# EAGLE design appleii (EAGLE 9.6.1)
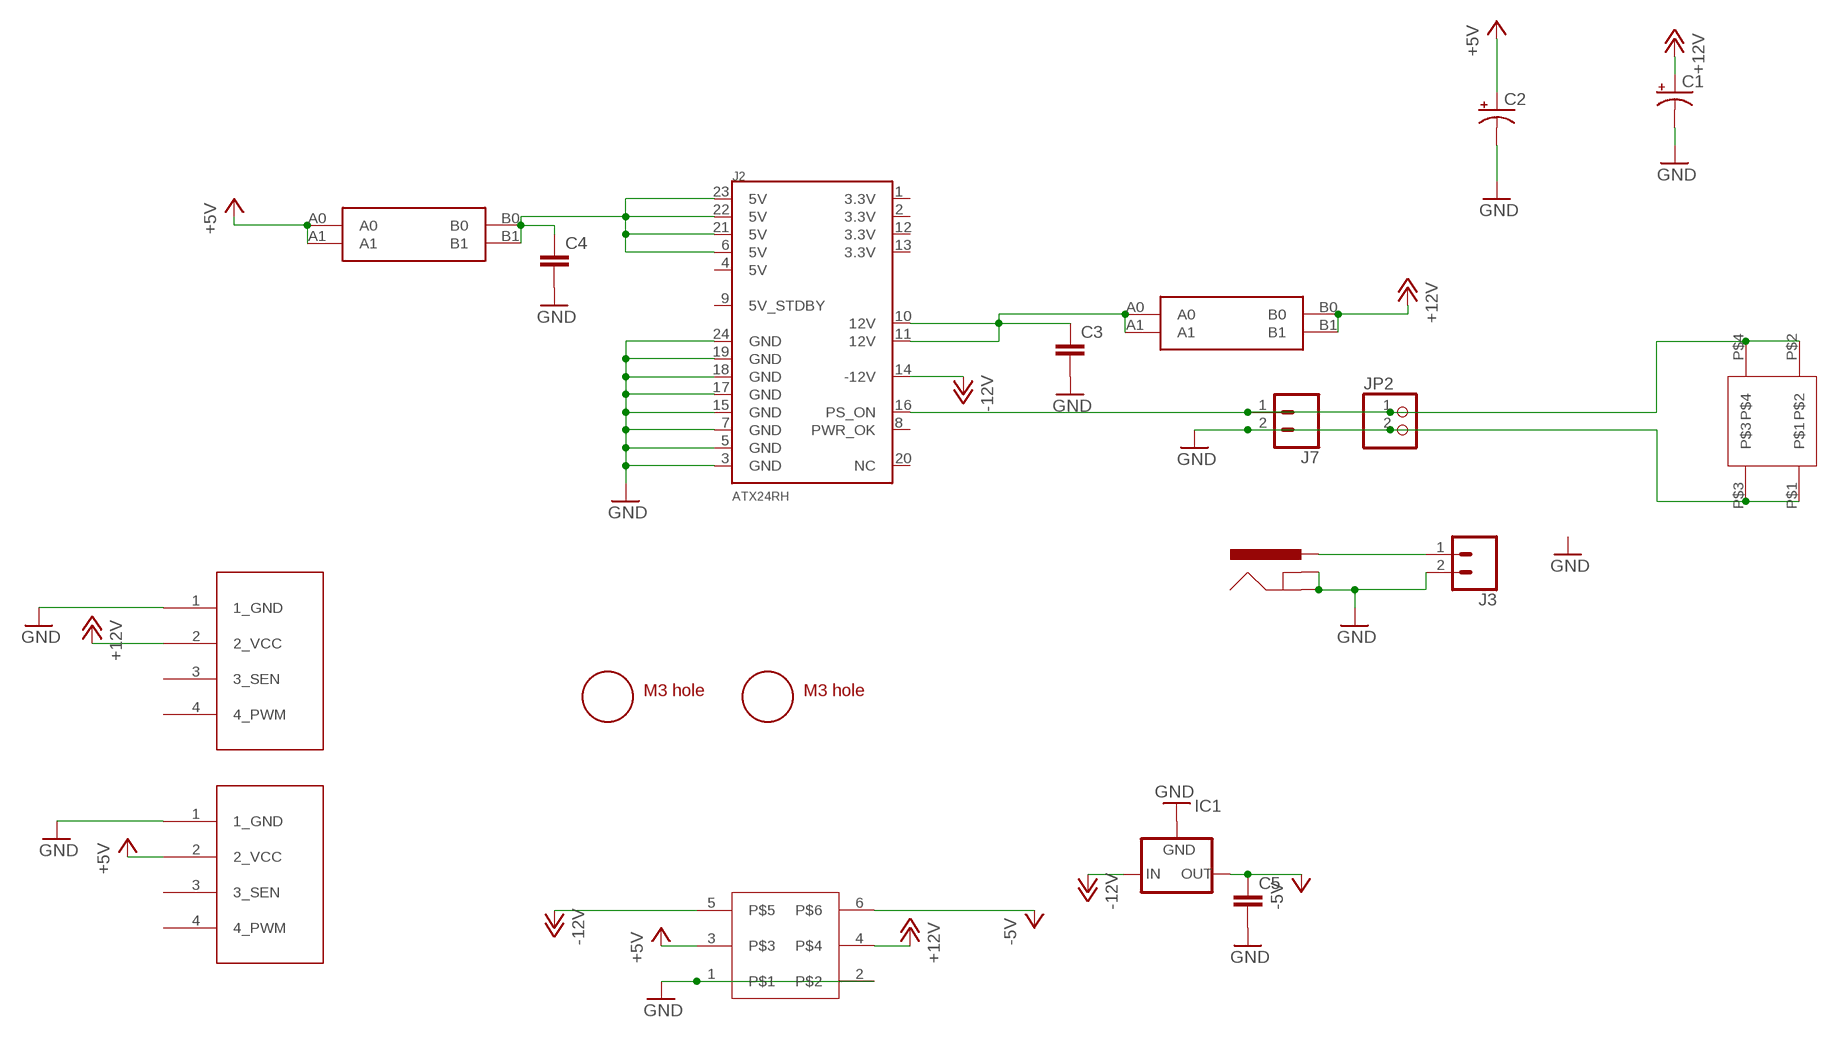
[diagram p0: schematic, sheet 1]

## Parts
C1  CPOL-USE5-10.5  [E5-10,5]
C2  CPOL-USE5-10.5  [E5-10,5]
C3  C5/2.5  [C5B2.5]
C4  C5/2.5  [C5B2.5]
C5  C5/2.5  [C5B2.5]
IC1  79XXS  [79XXS]
J1  POWER_JACKPTH  [POWER_JACK_PTH]
J2  ATX24RH  [ATX24_RIGHT_ANGLE]
J3  CONN_023.5MM-NO_SILK  [SCREWTERMINAL-3.5MM-2-NS]
J7  CONN_023.5MM-NO_SILK  [SCREWTERMINAL-3.5MM-2-NS]
JP1  4PIN_FAN  [1X04]
JP2  PINHD-1X2  [1X02]
JP4  4PIN_FAN  [1X04]
U$1  M3_MOUNTING_HOLE  [M3_MOUNTING_HOLE_PACK]
U$2  CAR_FUSE_HOLDER3IN1  [FUSE_HOLDER_3IN1]
U$3  M3_MOUNTING_HOLE  [M3_MOUNTING_HOLE_PACK]
U$4  APPLEII  [APPLEII]
U$5  ROCK_SW  [ROCK_SWITCH]
U$8  CAR_FUSE_HOLDER3IN1  [FUSE_HOLDER_3IN1]

## Nets
+5V: C2.+ JP4.2(2_VCC) U$4.3 U$8.A0 U$8.A1
+12V: C1.+ JP1.2(2_VCC) U$2.B0 U$2.B1 U$4.4
-5V: C5.1 IC1.OUT U$4.6
-12V: IC1.IN J2.14(-12V) U$4.5
GND: C1.- C2.- C3.2 C4.2 C5.2 IC1.GND J1.GND J1.GNDBREAK J2.3(GND) J2.5(GND) J2.7(GND) J2.15(GND) J2.17(GND) J2.18(GND) J2.19(GND) J2.24(GND) J3.2 J7.2 JP1.1(1_GND) JP2.2 JP4.1(1_GND) U$4.1 U$4.2 U$5.P$1 U$5.P$3
N$1: J1.PWR J3.1
N$5: J2.16(PS_ON) J7.1 JP2.1 U$5.P$2 U$5.P$4
N$6: C4.1 J2.6(5V) J2.21(5V) J2.22(5V) J2.23(5V) U$8.B0 U$8.B1
N$8: C3.1 J2.10(12V) J2.11(12V) U$2.A0 U$2.A1
Unconnected: J2.1(3.3V) J2.2(3.3V) J2.4(5V) J2.8(PWR_OK) J2.9(5V_STDBY) J2.12(3.3V) J2.13(3.3V) J2.20(NC) JP1.3(3_SEN) JP1.4(4_PWM) JP4.3(3_SEN) JP4.4(4_PWM)

## Library data of the parts
C1 C2 = rcl:CPOL-US: POLARIZED CAPACITOR, American symbol; SPICEPREFIX: C
C3-C5 = capacitor-wima:C: CAPACITOR naming: grid - package width
IC1 = v-reg:79XXS: VOLTAGE REGULATOR
J1 = appleii:POWER_JACK: Power Jack This is the standard 5.5mm barrel jack for power. The PTH is the most common, proven, reliable, footprint. All others are experimental. The Slot footprint only works if the mill layer is transmitted to the PCB fab house so be warned. Spark Fun Electronics SKU : PRT-00119. Mating wall wart : TOL-00298 (and others)
J2 = macse:ATX24: ATX24 Pin Power Supply Connector This is a good connector for connecting a computer power supply to a PCB. It's massive, but provides many amps of power at 5V and 12V. SKU: PRT-09498
J3 J7 = atx_power_control:CONN_02: Multi connection point. Often used as Generic Header-pin footprint for 0.1 inch spaced/style header connections On any of the 0.1 inch spaced packages, you can populate with these: Break Away Headers - Straight <https://www.sparkfun.com/products/116> (PRT-00116) Break Away Male Headers - Right Angle <https://www.sparkfun.com/products/553> (PRT-00553) Female Headers <https://www.sparkfun.com/products/115> (PRT-00115) Break Away Headers - Machine Pin <https://www.sparkfun.com/products/117> (PRT-00117) Break Away Female Headers - Swiss Machine Pin <https://www.sparkfun.com/products/743> (PRT-00743) For SCREWTERMINALS and SPRING TERMINALS visit here: Screw Terimnals on SparkFun.com <https://www.sparkfun.com/search/results?term=Screw+Terminals> (5mm/3.5mm/2.54mm spacing) This device is also useful as a general connection point to wire up your design to another part of your project. Our various solder wires solder well into these plated through hole pads. Hook-Up Wire - Assortment (Stranded, 22 AWG) <https://www.sparkfun.com/products/11375> (PRT-11375) Hook-Up Wire - Assortment (Solid Core, 22 AWG) <https://www.sparkfun.com/products/11367> (PRT-11367) View the entire wire category on our website here <https://www.sparkfun.com/categories/141> Special notes: Molex polarized connector foot print use with: PRT-08233 with associated crimp pins and housings. 2.54_SCREWTERM for use with PRT-10571. 3.5mm Screw Terminal footprints for PRT-08084 5mm Screw Terminal footprints for use with PRT-08432; PROD_ID: CONN-13512; SF_ID: PRT-09918; SF_SKU: PRT-08432; SKU: PRT-09914
JP1 JP4 = appleii:4PIN_FAN: PIN HEADER
JP2 = pinhead:PINHD-1X2: PIN HEADER
U$1 U$3 = a:M3_MOUNTING_HOLE
U$2 U$8 = atx_power_control:CAR_FUSE_HOLDER
U$4 = atx4vc:APPLEII
U$5 = atx4vc:ROCK_SW

## Board
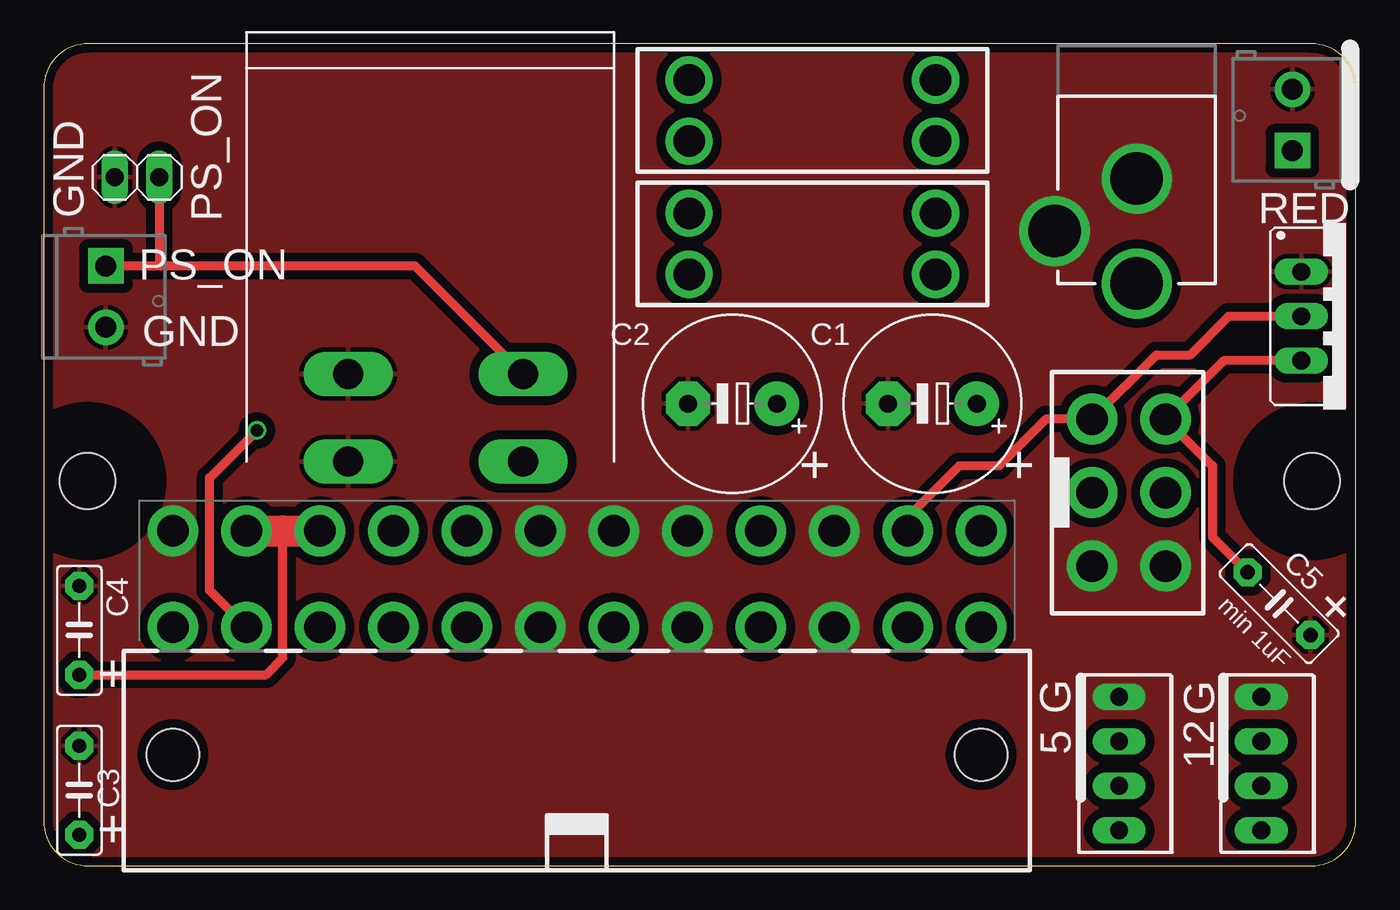
[diagram p1: board, top side]
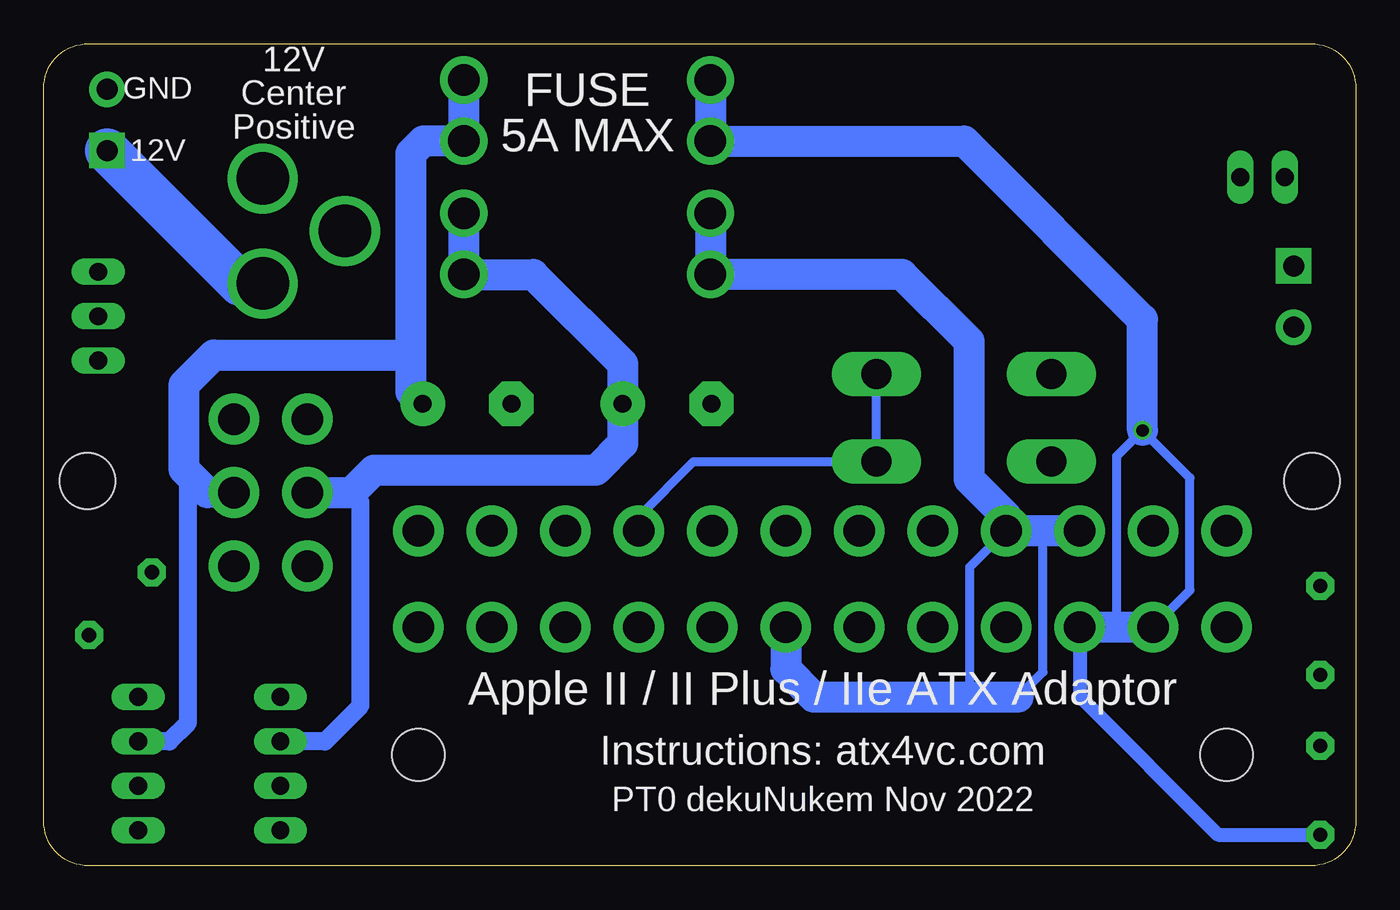
[diagram p2: board, bottom side, seen from below]

Size 75 x 47 mm. Coordinates in mm from the lower left corner, seen from the top.
Outline: 75,2.54 75,44.46 arc90 72.46,47 2.54,47 arc90 0,44.46 0,2.54 arc90 2.54,0 72.46,0 arc90 75,2.54
Copper layers (1*16): Top 0.035mm / dielectric 1.5mm / Bottom 0.035mm
Design rules "deku_2layer_6mil *": minimum track width 6mil, minimum drill 15mil, track to track 20mil, track to pad 6mil, pad to pad 6mil, via to via 6mil, smd to smd 6mil, copper to edge 10mil, drill to drill 6mil, minimum pad ring 7mil, minimum via ring 7mil, stop-mask expansion 4mil, vias tented up to drill 25mil, thermal gap 10mil
tRestrict: area -1.5,18 to 6.5,26; area 68.5,18 to 76.5,26

### Footprints (pad centres in the part's own frame; a part is rotated, then mirrored left to right if it is on the bottom)
E5-10,5 = drill 1.016 pad 2.54: + -2.54,0 | drill 1.016 pad 2.54 octagon: - 2.54,0
C5B2.5 = drill 0.813 pad 1.6 octagon: 1 -2.54,0; 2 2.54,0
79XXS = drill 1.016 long: GND -2.54,-2.54; IN 0,-2.54; OUT 2.54,-2.54
POWER_JACK_PTH = drill 2.997: GND 0,7.7; GNDBREAK 4.7,10.7; PWR 0,13.7
ATX24_RIGHT_ANGLE = drill 1.8 pad 2.9: 1 23.1,4.76; 2 18.9,4.76; 3 14.7,4.76; 4 10.5,4.76; 5 6.3,4.76; 6 2.1,4.76; 7 -2.1,4.76; 8 -6.3,4.76; 9 -10.5,4.76; 10 -14.7,4.76; 11 -18.9,4.76; 12 -23.1,4.76; 13 23.1,10.26; 14 18.9,10.26; 15 14.7,10.26; 16 10.5,10.26; 17 6.3,10.26; 18 2.1,10.26; 19 -2.1,10.26; 20 -6.3,10.26; 21 -10.5,10.26; 22 -14.7,10.26; 23 -18.9,10.26; 24 -23.1,10.26 | hole 3: -23.1,-2.54; 23.1,-2.54
SCREWTERMINAL-3.5MM-2-NS = drill 1.2 pad 2.032 square: 1 0,0 | drill 1.2 pad 2.032: 2 3.5,0
1X04 = drill 1.016 long: 1 -3.81,0; 2 -1.27,0; 3 1.27,0; 4 3.81,0
1X02 = drill 1.016 long: 1 -1.27,0; 2 1.27,0
M3_MOUNTING_HOLE_PACK = hole 3.2: 0,0
FUSE_HOLDER_3IN1 = drill 1.8: A0 -7.05,1.75; A1 -7.05,-1.75; B0 7.05,1.75; B1 7.05,-1.75
APPLEII = drill 1.8 pad 2.9: 1 4.2,-2.05; 2 4.2,2.15; 3 0,-2.05; 4 0,2.15; 5 -4.2,-2.05; 6 -4.2,2.15
ROCK_SWITCH = drill 1.7 long: P$1 -4.7,0; P$2 5.3,0; P$3 -4.7,5; P$4 5.3,5

### Placement (x,y rotation side)
C1  50.8,26.42 180 top
C2  39.37,26.42 180 top
C3  2.03,4.32 90 top
C4  2.03,13.46 90 top
C5  70.61,14.99 315 top
IC1  74.42,31.42 270 top
J1  62.48,46.99 180 top
J2  30.48,8.89 0 top
J3  71.37,40.89 90 top
J7  3.56,34.29 270 top
JP1  69.6,5.84 270 top
JP2  5.33,39.37 180 top
JP4  61.47,5.84 270 top
U$1  2.5,22 0 top
U$2  43.94,43.18 0 top
U$3  72.5,22 0 top
U$4  61.98,21.34 270 top
U$5  22.1,23.11 0 top
U$8  43.94,35.56 180 top

### Tracks (layer width: path | path; a pad name or v marks a point on that pad's centre or on a via)
+5V
  Bottom 1.016: JP4.2 58.93,7.11 56.9,9.14 56.9,20.83 57.4,21.34
  Bottom 1.778: U$8.A1 U$8.A0 47.02,33.81 41.91,28.7 C2.+ 41.91,24.13 43.43,22.61 56.13,22.61 57.4,21.34 U$4.3
+12V
  Bottom 1.016: JP1.2 67.82,7.11 66.75,8.18 66.75,22.44 66.98,22.67
  Bottom 1.778: U$2.B0 U$2.B1 53.31,41.43 54.03,40.72 54.03,29.21 | C1.+ 54.03,27.09 54.03,29.21 | U$4.4 65.65,21.34 66.98,22.67 66.98,27.51 65.28,29.21 54.03,29.21
-5V
  Top 0.508: IC1.OUT 67.47,28.88 U$4.6 66.8,22.86 66.8,18.8 C5.1
-12V
  Top 0.508: J2.14 49.38,19.92 52.32,22.86 54.61,22.86 57.29,25.54 U$4.5 63.6,29.21 65.53,29.21 67.74,31.42 IC1.IN
GND
  pour Top (isolate 0.508): 75,47 0,47 0,-0.06 75,-0.06
N$1
  Bottom 2.54: J3.1 63.77,33.29 J1.PWR
N$5
  Top 0.508: 6.6,34.29 21.22,34.29 U$5.P$4 | 6.6,34.29 J7.1 | JP2.1 6.6,34.29
  Bottom 0.508: J2.16 40.98,19.98 37.85,23.11 U$5.P$2 U$5.P$4
N$6
  Top 0.508: C4.1 12.7,10.92 13.66,11.89 13.66,19.15
  Top 1.778: J2.23 13.66,19.15 J2.22
  Bottom 0.508: J2.21 22.07,17.06 22.07,9.68 22.1,9.65 | 19.3,9.65 17.88,11.07 17.88,19.15
  Bottom 1.778: J2.22 17.88,19.15 J2.21 19.98,19.98 22.1,22.1 22.1,29.97 25.94,33.81 U$8.B0 U$8.B1 | J2.6 32.58,11.24 30.99,9.65 22.1,9.65 19.3,9.65
N$8  (via drill 0.7)
  Top 0.508: J2.11 9.47,15.76 9.47,22.17 v12.19,24.89
  Bottom 0.508: J2.11 9.47,15.76 9.47,22.17 v12.19,24.89 13.66,23.42 13.66,13.7 13.72,13.65
  Bottom 0.813: J2.10 15.78,9.68 7.87,1.78 C3.1
  Bottom 1.778: J2.10 13.72,13.65 J2.11 | v12.19,24.89 12.19,31.24 22.38,41.43 U$2.A1 U$2.A0

### Text on the board
tNames: PS_ON | GND | RED | PS_ON | GND | + | + | + | min 1uF | + | G | G | 5 | 12 | +
bNames: 12V / Center / Positive | GND | FUSE / 5A MAX | 12V | Apple II / II Plus / IIe ATX Adaptor | Instructions: atx4vc.com | PT0 dekuNukem Nov 2022